# Altium schematic sheet FLEX_TOP_IO.SchDoc
size A4
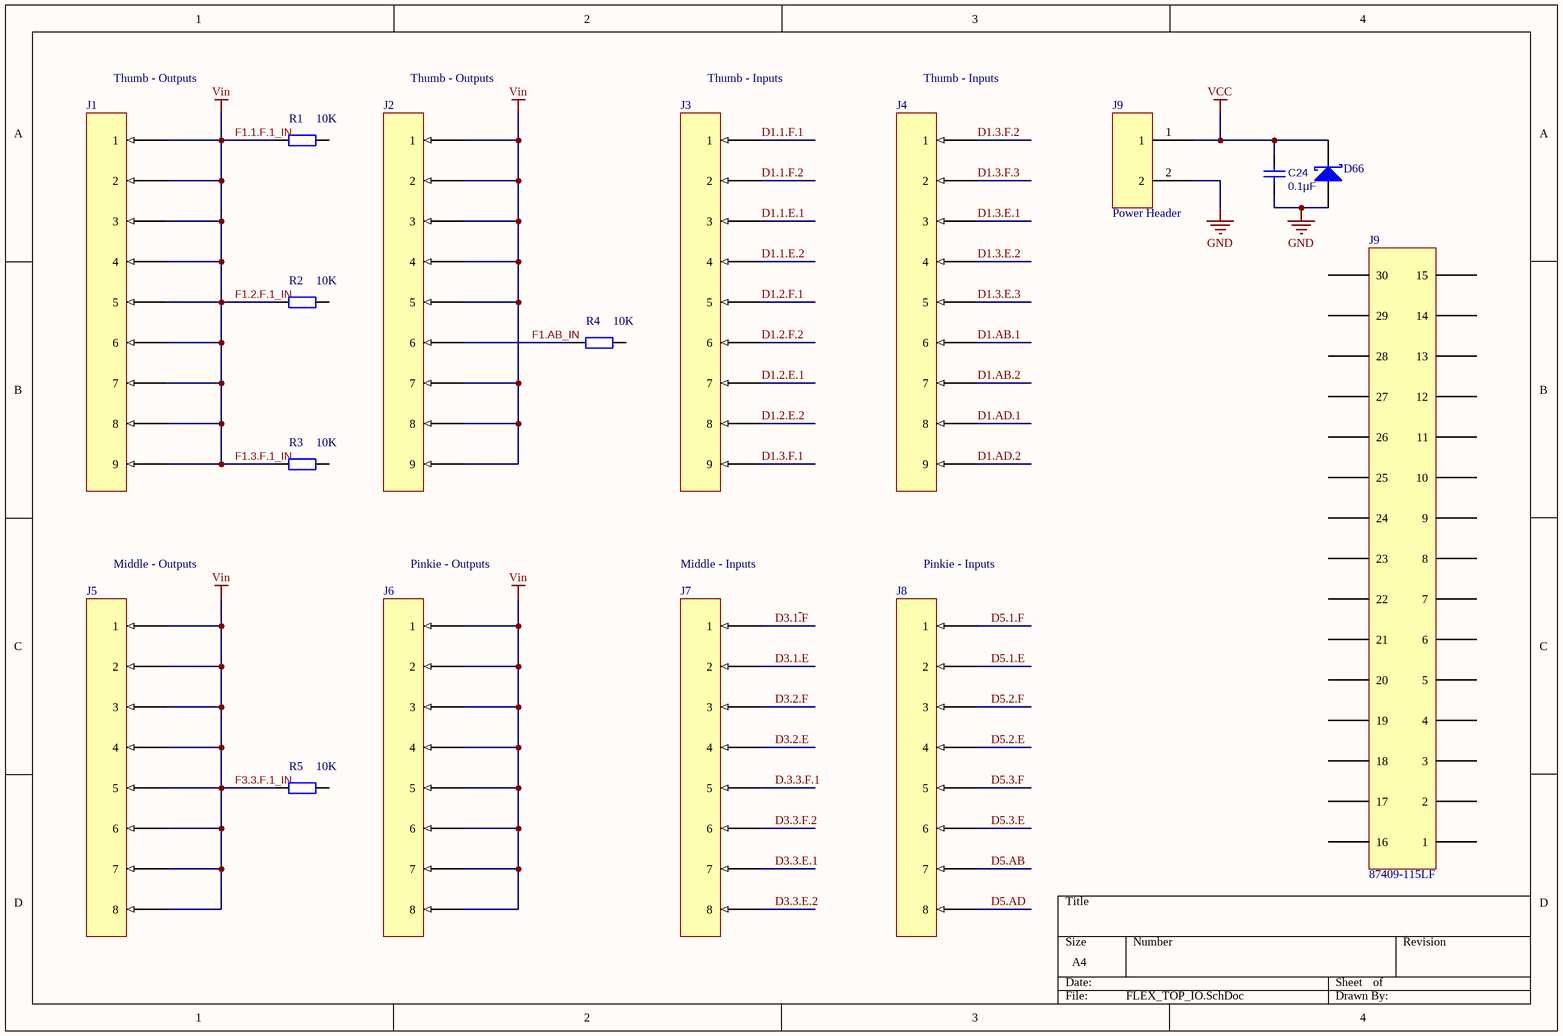
[diagram p0: FLEX_TOP_IO.SchDoc]

## Parts
(Parts that share a designator on the sheet are numbered #1, #2 ... from top to bottom, then left to right.)
C24  value 0.1µF  [TDK C-Series (1608)]
D66  Diode BAT17  [Diode_TVS]  (value not drawn)
J1  Name2  [9PIN_CONNECTOR]  (value not drawn)
J2  Name2  [9PIN_CONNECTOR]  (value not drawn)
J3  Name2  [9PIN_CONNECTOR]  (value not drawn)
J4  Name2  [9PIN_CONNECTOR]  (value not drawn)
J5  3-794630-8  [8PIN_CONNECTOR]  (value not drawn)
J6  3-794630-8  [8PIN_CONNECTOR]  (value not drawn)
J7  3-794630-8  [8PIN_CONNECTOR]  (value not drawn)
J8  3-794630-8  [8PIN_CONNECTOR]  (value not drawn)
J9#1  Power Header  [2PIN_POWERHEADER]
J9#2  87409-115LF
R1  value 10K  [Panasonic ERJ-Series (1608)]
R2  value 10K  [Panasonic ERJ-Series (1608)]
R3  value 10K  [Panasonic ERJ-Series (1608)]
R4  value 10K  [Panasonic ERJ-Series (1608)]
R5  value 10K  [Panasonic ERJ-Series (1608)]

## Nets
F1.1.F.1_IN: J1.1 J1.3 J1.4 J1.5 J1.6 J1.7 J1.8 J1.9 J1.66(2) J2.1 J2.3 J2.4 J2.5 J2.7 J2.8 J2.9 J2.66(2) J5.1 J5.3 J5.4 J5.5 J5.6 J5.7 J5.8 J5.66(2) J6.1 J6.3 J6.4 J6.5 J6.6 J6.7 J6.8 J6.66(2) R1.2 R2.2 R3.2 R5.2  [also labelled F1.2.F.1_IN, F1.3.F.1_IN, F3.3.F.1_IN, Vin]
GND: C24.1 D66.1(A) J9#1.2
VCC: C24.2 D66.3(K) J9#1.1
D1.1.E.1: J3.3
D1.1.E.2: J3.4
D1.1.F.1: J3.1
D1.1.F.2: J3.66(2)
D1.2.E.1: J3.7
D1.2.E.2: J3.8
D1.2.F.1: J3.5
D1.2.F.2: J3.6
D1.3.E.1: J4.3
D1.3.E.2: J4.4
D1.3.E.3: J4.5
D1.3.F.1: J3.9
D1.3.F.2: J4.1
D1.3.F.3: J4.66(2)
D1.AB.1: J4.6
D1.AB.2: J4.7
D1.AD.1: J4.8
D1.AD.2: J4.9
D3.1~{.}F: J7.1
D3.1.E: J7.66(2)
D3.2.E: J7.4
D3.2.F: J7.3
D3.3.E.1: J7.7
D3.3.E.2: J7.8
D3.3.F.2: J7.6
D5.1.E: J8.66(2)
D5.1.F: J8.1
D5.2.E: J8.4
D5.2.F: J8.3
D5.3.E: J8.6
D5.3.F: J8.5
D5.AB: J8.7
D5.AD: J8.8
D.3.3.F.1: J7.5
F1.AB_IN: J2.6 R4.2

Not connected (* = marked no-connect by the designer): J9#2 1 2 3 4 5 6 7 8 9 10 11 12 13 14 15 16 17 18 19 20 21 22 23 24 25 26 27 28 29 30; R1 1; R2 1; R3 1; R4 1; R5 1

## Notes on the sheet
- Thumb - Outputs
- Thumb - Inputs
- Middle - Outputs
- Pinkie - Outputs
- Middle - Inputs
- Pinkie - Inputs

## Library data of the parts
C24 = Cap: Capacitor; Published: 8-Jun-2000; LatestRevisionDate: 17-Jul-2002; LatestRevisionNote: Re-released for DXP Platform.; PackageReference: RAD-0.3; Publisher: Altium Limited; PackageDescription: Radial Cap, Thru-Hole; 2 Leads; 0.3 in Pin Spacing; Supplier 1: Digi-Key; Supplier Part Number 1: 445-1316-1-ND
D66 = Diode BAT17: Silicon RF Schottky Diode for Mixer Applications in the VHF/UHF Range; Note: Pin 2 is not connected and not drawn.; Published: 21-Mar-2003; LatestRevisionDate: 29-May-2009; LatestRevisionNote: IPC-7351 Footprint Added.; DatasheetVersion: Oct-1999; PackageVersion: Sep-2001; PackageReference: SOT-23; Publisher: Altium Limited; PackageDescription: 3-Pin SOT-23 Package 0.95 mm Pitch, 2.5 mm Lead Span; ComponentLink1Description: Manufacturer Link; ComponentLink1URL: http://www.infineon.com/; ComponentLink2Description: Datasheet; ComponentLink2URL: http://www.infineon.com/upload/Document/cmc_upload/documents/009/363/bat17series.pdf; Supplier 1: Digi-Key; Supplier Part Number 1: DF2S10FSL3MCT-ND
J1-J4 = Name2: 9 Position header
J5-J8 = 3-794630-8: 8 Position Header; Supplier 1: Digi-Key; Supplier Part Number 1: A33222-ND
R1-R5 = Res2: Resistor; Published: 8-Jun-2000; LatestRevisionDate: 17-Jul-2002; LatestRevisionNote: Re-released for DXP Platform.; PackageReference: AXIAL-0.4; Publisher: Altium Limited; PackageDescription: Axial Device, Thru-Hole; 2 Leads; 0.4 in Pin Spacing; Supplier 1: Digi-Key; Supplier 2: Digi-Key; Supplier Part Number 2: P10.0KHCT-ND
J9#1 = Power Header: Supplier 1: Digi-Key; Supplier Part Number 1: ED2675-ND